# Altium schematic sheet Nguyen_Ly.SchDoc
size A4; SheetNumber: 1; SheetTotal: 1
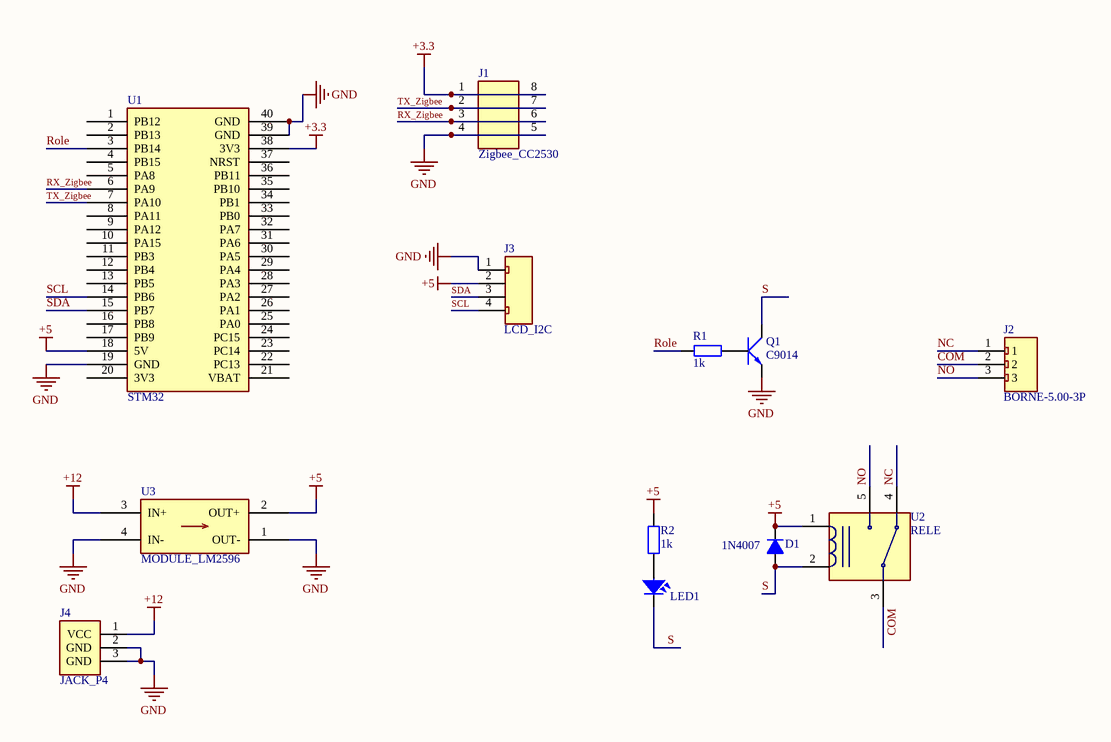
[diagram p0: Nguyen_Ly.SchDoc]

## Parts
D1  1N4007  [D1A]
J1  Zigbee_CC2530  [FEMALE-2.54-4x2P]
J2  BORNE-5.00-3P  [BORNE-5.00-3P]
J3  LCD_I2C  [JST-2.00-4P]
J4  JACK_P4  [JACK_P4]
LED1  LED  [LED-3]  (value not drawn)
Q1  C9014  [QTO-92]
R1  1k  [R1/4W]
R2  1k  [R1/4W]
U1  STM32  [STM32]
U2  RELE  [RELE]
U3  MODULE_LM2596  [MODULE_LM2596]

## Nets
+3.3: J1.1 J1.8 U1.38(3V3)
+5: D1.2(K) J3.2 R2.2 U1.18(5V) U2.1 U3.2(OUT+)
+12: J4.1(VCC) U3.3(IN+)
GND: J1.4 J1.5 J3.1 J4.2(GND) J4.3(GND) Q1.1(E) U1.19(GND) U1.39(GND) U1.40(GND) U3.1(OUT-) U3.4(IN-)
COM: J2.2 U2.3
NC: J2.1 U2.4
NO: J2.3 U2.5
Role: R1.1 U1.3(PB14)
RX_Zigbee: J1.3 J1.6 U1.6(PA9)
S: D1.1(A) LED1.2 Q1.3(C) U2.2
SCL: J3.4 U1.14(PB6)
SDA: J3.3 U1.15(PB7)
TX_Zigbee: J1.2 J1.7 U1.7(PA10)
NetLED1_1: LED1.1 R2.1
NetQ1_2: Q1.2(B) R1.2

Not connected (* = marked no-connect by the designer): U1 1(PB12) 2(PB13) 4(PB15) 5(PA8) 8(PA11) 9(PA12) 10(PA15) 11(PB3) 12(PB4) 13(PB5) 16(PB8) 17(PB9) 20(3V3) 21(VBAT) 22(PC13) 23(PC14) 24(PC15) 25(PA0) 26(PA1) 27(PA2) 28(PA3) 29(PA4) 30(PA5) 31(PA6) 32(PA7) 33(PB0) 34(PB1) 35(PB10) 36(PB11) 37(NRST)

## Library data of the parts
D1 = D1A: Diode 1A; Value: 1N4007
J1 = FEMALE-2.54-4x2P: Female Header Connector 2.54mm 4x2 Pins.; JLCPCB PN: C2977588
J2 = BORNE-5.00-3P: Borne 3 Vias, Pitch 5mm.; JLCPCB PN: C91154
J3 = JST-2.00-4P: Female Connector JST 4 Vias, 2.00mm.; JLCPCB PN: C5175232
J4 = JACK_P4: 9V Battery Connector Jack P4.
LED1 = LED: LED Single colour Green and Red; Value: LED 3 ly Single Colour
Q1 = NPN_EBC: P 600mW, EBC; Value: C9014
R1 R2 = R1/4W: Resistor 1/4W; Value: R1/4W - 1K
U2 = RELE: Generic Rele PTH 5 Pins.
U3 = MODULE_LM2596: MODULE BUCK STEP DOWN 3A 43x20mm; ComponentLink1Description: Datasheet; ComponentLink1URL: https://www.ti.com/lit/ds/symlink/lm2596.pdf